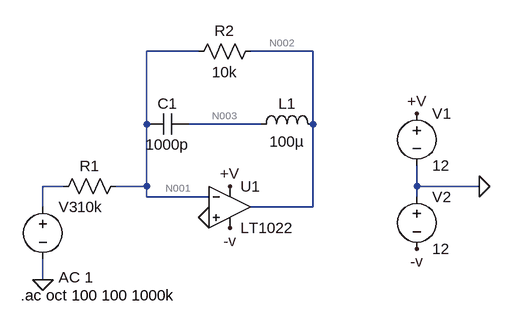
[diagram p0: schematic Draft27.asc]
Draft27.asc, the LTspice schematic file:
Version 4
SHEET 1 880 680
WIRE 144 -16 64 -16
WIRE 320 -16 224 -16
WIRE 64 96 64 -16
WIRE 240 96 128 96
WIRE 320 96 320 -16
WIRE -64 192 -96 192
WIRE 64 192 64 96
WIRE 64 192 16 192
WIRE 480 192 480 160
WIRE 576 192 480 192
WIRE 64 208 64 192
WIRE 160 208 64 208
WIRE 480 208 480 192
WIRE -96 224 -96 192
WIRE 320 224 320 96
WIRE 320 224 224 224
WIRE -96 336 -96 304
FLAG -96 336 0
FLAG 160 240 0
FLAG 576 192 0
FLAG 192 192 +V
FLAG 480 80 +V
FLAG 192 256 -v
FLAG 480 288 -v
SYMBOL voltage 480 64 R0
SYMATTR InstName V1
SYMATTR Value 12
SYMBOL voltage 480 192 R0
SYMATTR InstName V2
SYMATTR Value 12
SYMBOL voltage -96 208 R0
WINDOW 123 24 124 Left 2
WINDOW 39 0 0 Left 0
SYMATTR InstName V3
SYMATTR Value ""
SYMATTR Value2 AC 1
SYMBOL Opamps\\LT1022 192 160 R0
SYMATTR InstName U1
SYMBOL cap 128 80 R90
WINDOW 0 0 32 VBottom 2
WINDOW 3 32 32 VTop 2
SYMATTR InstName C1
SYMATTR Value 1000p
SYMBOL ind 224 112 R270
WINDOW 0 32 56 VTop 2
WINDOW 3 5 56 VBottom 2
SYMATTR InstName L1
SYMATTR Value 100µ
SYMBOL res 32 176 R90
WINDOW 0 0 56 VBottom 2
WINDOW 3 32 56 VTop 2
SYMATTR InstName R1
SYMATTR Value 10k
SYMBOL res 240 -32 R90
WINDOW 0 0 56 VBottom 2
WINDOW 3 32 56 VTop 2
SYMATTR InstName R2
SYMATTR Value 10k
TEXT -130 360 Left 2 !.ac oct 100 100 1000k

The netlist it stands for:
* Draft27.asc
V1 +V 0 12
V2 0 -v 12
V3 N004 0 AC 1
XU1 0 N001 +V -v N002 LT1022  ; pins In+ In- V+ V- OUT
C1 N003 N001 1000p
L1 N003 N002 100µ
R1 N001 N004 10k
R2 N002 N001 10k
.ac oct 100 100 1000k
.backanno
.end

* Results of the author's LTspice run, read from the files saved beside the schematic
* Operating Point, zero values left out:
*   V(+v) = 12 V
*   V(-v) = -12 V
*   I(V2) = -5.2 mA
*   I(V1) = -5.2 mA
*   Ix(u1:3) = 5.2 mA
*   Ix(u1:4) = -5.2 mA
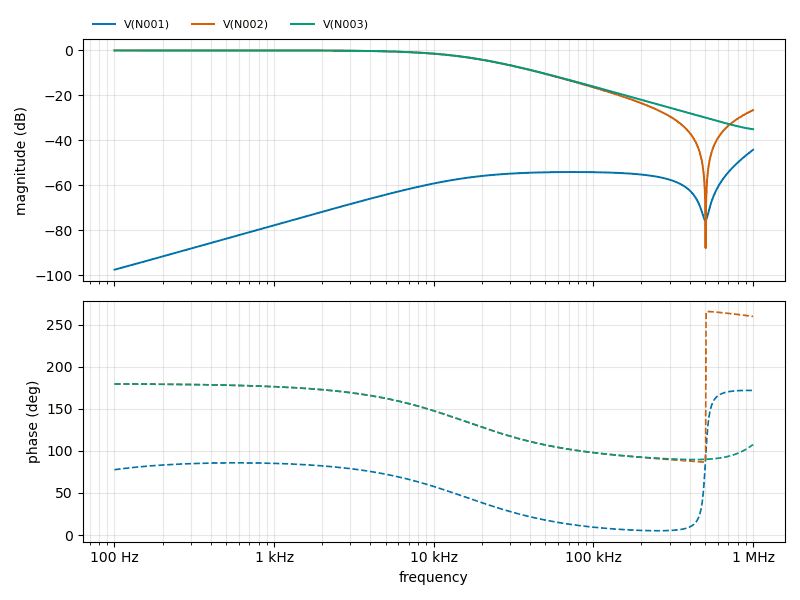
[diagram p1: AC Analysis of Draft27.asc, plotted from the saved traces]
* AC Analysis, 1 run:
*   V(N001): -97.56 dB at 100 Hz, -44.22 dB at 1 MHz, peak -44.22 dB at 1 MHz, 3 dB below the peak at 884.5 kHz
*   V(N002): -0.00 dB at 100 Hz, -26.56 dB at 1 MHz, peak -0.00 dB at 100 Hz, 3 dB below the peak at 15.87 kHz
*   V(N003): -0.00 dB at 100 Hz, -35.05 dB at 1 MHz, peak -0.00 dB at 100 Hz, 3 dB below the peak at 15.9 kHz